# EAGLE design RCM-Comm_v4 (EAGLE 9.2.2)
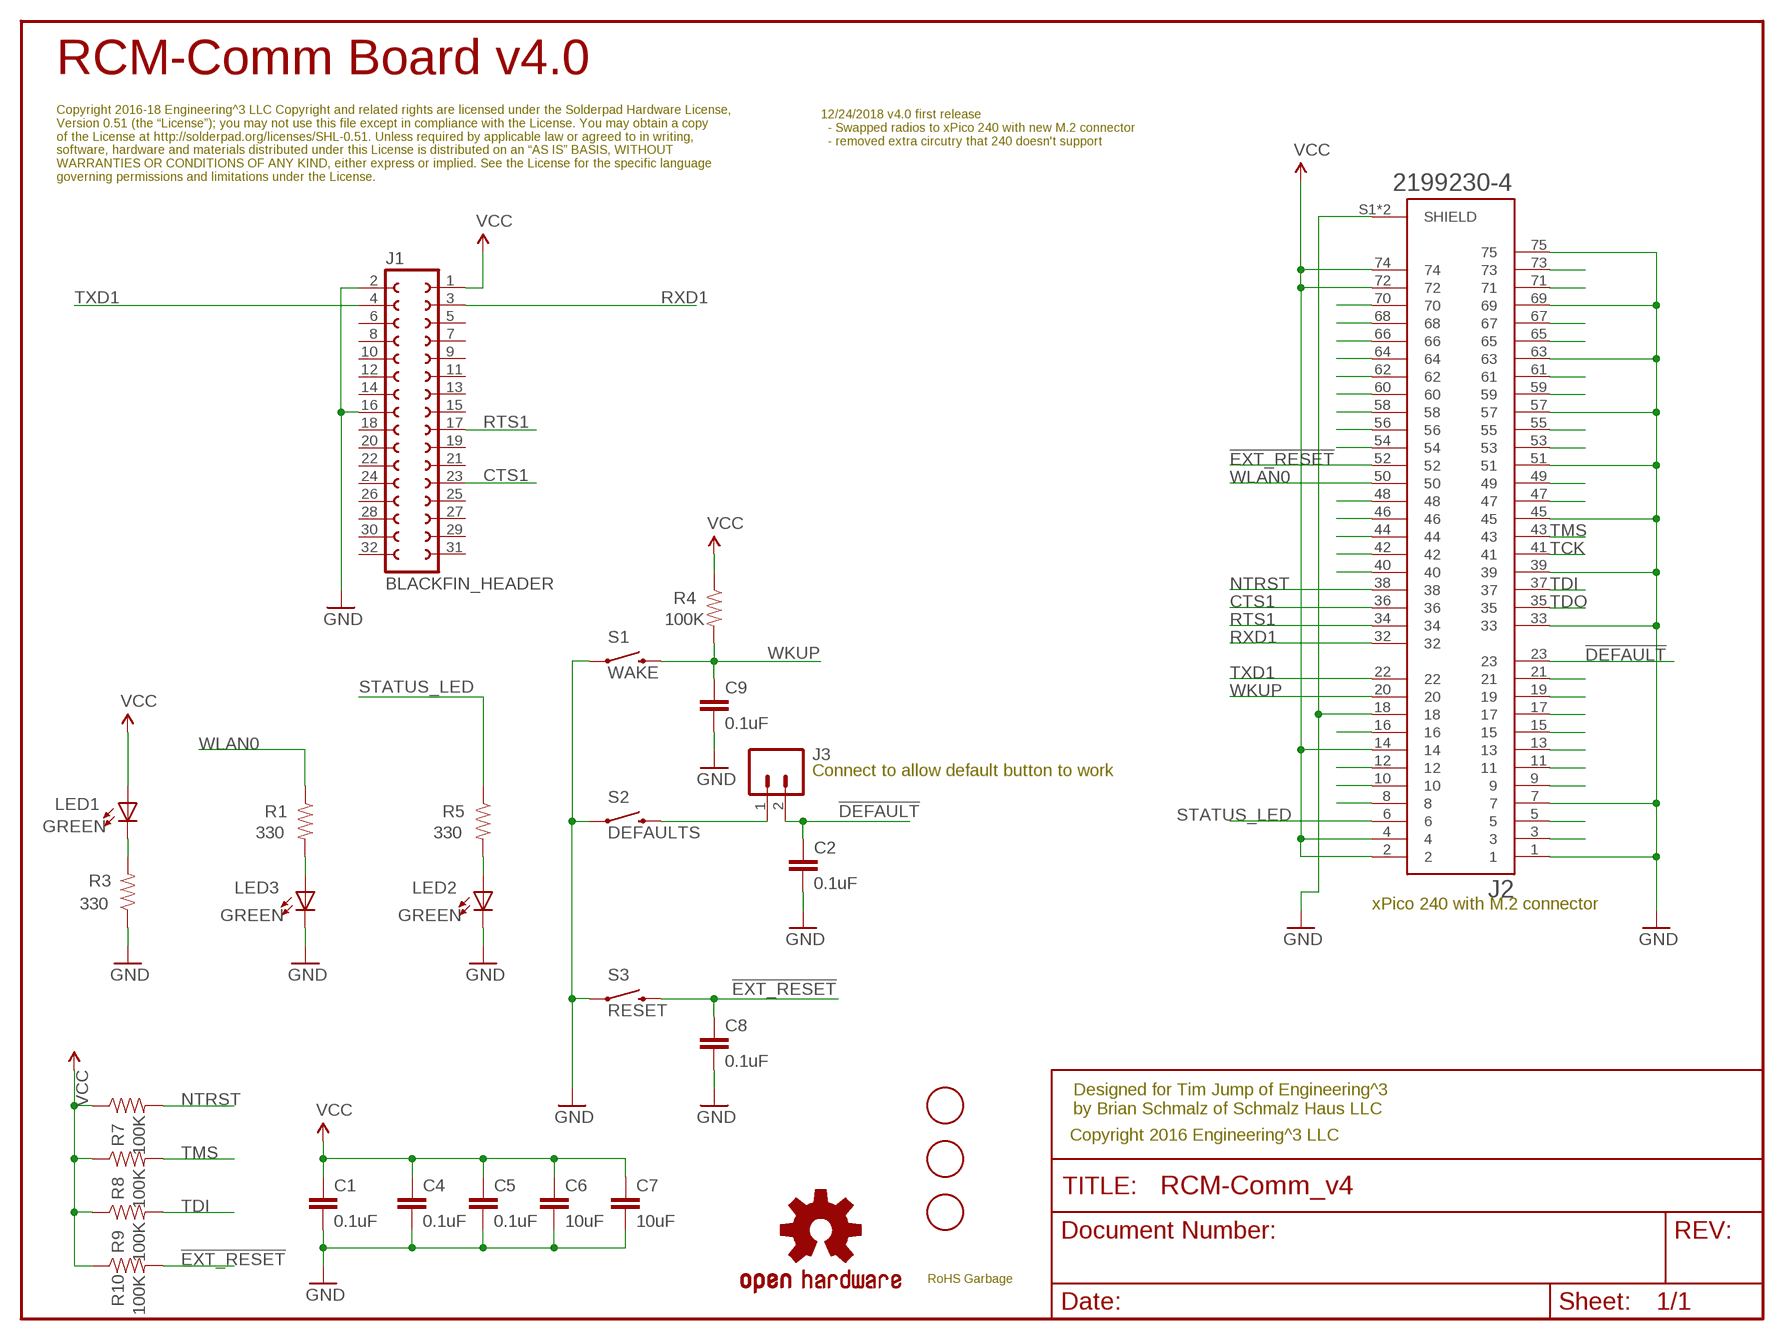
[diagram p0: schematic, sheet 1]

## Parts
C1  0.1uF  0.1UF-25V(+80/-20%)(0603)  [0603-CAP]
C2  0.1uF  0.1UF-25V(+80/-20%)(0603)  [0603-CAP]
C4  0.1uF  0.1UF-25V(+80/-20%)(0603)  [0603-CAP]
C5  0.1uF  0.1UF-25V(+80/-20%)(0603)  [0603-CAP]
C6  10uF  10UF-6.3V-20%(0603)  [0603-CAP]
C7  10uF  10UF-6.3V-20%(0603)  [0603-CAP]
C8  0.1uF  0.1UF-25V(+80/-20%)(0603)  [0603-CAP]
C9  0.1uF  0.1UF-25V(+80/-20%)(0603)  [0603-CAP]
FID1  FIDUCIAL  [FIDUCIAL_1MM]
FID2  FIDUCIAL  [FIDUCIAL_1MM]
FID3  FIDUCIAL  [FIDUCIAL_1MM]
J1  BLACKFIN_HEADER  [2X16]
J2  2199230-4  [TE_2199230-4]
J3  CONN_02  [1X02]
LED1  GREEN  LED0603  [LED-0603]
LED2  GREEN  LED0603  [LED-0603]
LED3  GREEN  LED0603  [LED-0603]
LOGO1  OSHW-LOGOM  [OSHW-LOGO-M]
R1  330  RESISTOR0603-RES  [0603-RES]
R3  330  RESISTOR0603-RES  [0603-RES]
R4  100K  RESISTOR0603-RES  [0603-RES]
R5  330  RESISTOR0603-RES  [0603-RES]
R7  100K  RESISTOR0603-RES  [0603-RES]
R8  100K  RESISTOR0603-RES  [0603-RES]
R9  100K  RESISTOR0603-RES  [0603-RES]
R10  100K  RESISTOR0603-RES  [0603-RES]
S1  WAKE  SWITCH-MOMENTARY-2SMD  [TACTILE-SWITCH-SMD]
S2  DEFAULTS  SWITCH-MOMENTARY-2SMD  [TACTILE-SWITCH-SMD]
S3  RESET  SWITCH-MOMENTARY-2SMD  [TACTILE-SWITCH-SMD]
U$3  ROHS_GARBAGE  [ROHS_GARBAGE_5MM]

## Nets
!DEFAULT!: C2.1 J2.23 J3.2
!EXT_RESET!: C8.1 J2.52 R10.2 S3.3
CTS1: J1.23(GP6) J2.36
GND: C1.2 C2.2 C4.2 C5.2 C6.2 C7.2 C8.2 C9.2 J1.2(GND) J1.16(GND16) J2.1 J2.7 J2.18 J2.33 J2.39 J2.45 J2.51 J2.57 J2.63 J2.69 J2.75 J2.S1(SHIELD) J2.S2(SHIELD) LED2.C LED3.C R3.1 S1.1 S2.1 S3.1
N$1: J3.1 S2.3
N$2: LED3.A R1.2
N$3: LED1.C R3.2
N$6: LED2.A R5.2
N$9: J2.3
N$10: J2.5
N$12: J2.9
N$13: J2.11
N$14: J2.13
N$15: J2.15
N$16: J2.17
N$17: J2.19
N$18: J2.21
N$23: J2.8
N$25: J2.10
N$27: J2.12
N$29: J2.16
N$40: J2.47
N$41: J2.49
N$43: J2.53
N$44: J2.55
N$46: J2.59
N$47: J2.61
N$49: J2.65
N$50: J2.67
N$52: J2.71
N$53: J2.73
N$58: J2.70
N$59: J2.68
N$60: J2.66
N$61: J2.64
N$62: J2.62
N$63: J2.60
N$64: J2.58
N$65: J2.56
N$66: J2.54
N$69: J2.48
N$70: J2.46
N$71: J2.44
N$72: J2.42
N$73: J2.40
NTRST: J2.38 R7.2
RTS1: J1.17(GP0) J2.34
RXD1: J1.3(TX0) J2.32
STATUS_LED: J2.6 R5.1
TCK: J2.41
TDI: J2.37 R9.2
TDO: J2.35
TMS: J2.43 R8.2
TXD1: J1.4(RX0) J2.22
VCC: C1.1 C4.1 C5.1 C6.1 C7.1 J1.1(3.3V) J2.2 J2.4 J2.14 J2.72 J2.74 LED1.A R4.1 R7.1 R8.1 R9.1 R10.1
WKUP: C9.1 J2.20 R4.2 S1.3
WLAN0: J2.50 R1.1
Unconnected: J1.5(TX1) J1.6(RX1) J1.7(TMR2) J1.8(TMR3) J1.9(SPI_MOSI) J1.10(SPI_MISO) J1.11(SPI_SCK) J1.12(SPI_SEL) J1.13(SPI_SEL2) J1.14(SPI_SCL) J1.15(I2C_SDA) J1.18(GP1) J1.19(GP2) J1.20(GP3) J1.21(GP4) J1.22(GP5) J1.24(GP7) J1.25(GP8) J1.26(GP9) J1.27(GPA) J1.28(GPB) J1.29(GPC) J1.30(GPD) J1.31(GPE) J1.32(GPF)

## Notes on the sheet
- RCM-Comm Board v4.0
- 12/24/2018 v4.0 first release
    - Swapped radios to xPico 240 with new M.2 connector
    - removed extra circutry that 240 doesn't support
- Copyright 2016-18 Engineering^3 LLC Copyright and related rights are licensed under the Solderpad Hardware License, 
  Version 0.51 (the “License”); you may not use this file except in compliance with the License. You may obtain a copy 
  of the License at http://solderpad.org/licenses/SHL-0.51. Unless required by applicable law or agreed to in writing, 
  software, hardware and materials distributed under this License is distributed on an “AS IS” BASIS, WITHOUT 
  WARRANTIES OR CONDITIONS OF ANY KIND, either express or implied. See the License for the specific language 
  governing permissions and limitations under the License.
- Connect to allow default button to work
- xPico 240 with M.2 connector
- Designed for Tim Jump of Engineering^3
  by Brian Schmalz of Schmalz Haus LLC
- Copyright 2016 Engineering^3 LLC

## Library data of the parts
C1 C2 C4 C5 C8 C9 = SparkFun-Capacitors:0.1UF-25V(+80/-20%)(0603): CAP-00810 Ceramic Standard decoupling cap; PROD_ID: CAP-00810
C6 C7 = SparkFun-Capacitors:10UF-6.3V-20%(0603): CAP-11015; PROD_ID: CAP-11015
FID1-FID3 = adafruit:FIDUCIAL: For use by pick and place machines to calibrate the vision/machine, 1mm By microbuilder.eu
J1 = Surveyor:BLACKFIN_HEADER
J2 = TE_Conn_M_2_Connector_2199230-4:2199230-4: CONNECTOR, BACKPLANE, HOUSING, RCPT, 67POS, 2ROW; Connector Type: Card Edge; Seri; COMMENT: 2199230-4; DESCRIPTION: Connector, Backplane, Housing, Receptacle, 67 Position, 2row; DIGI-KEY_PART_NUMBER: A115904CT-ND; DIGI-KEY_PURCHASE_URL: https://www.digikey.com/product-detail/en/te-connectivity-amp-connectors/2199230-4/A115904CT-ND/4208916?utm_source=snapeda&utm_medium=aggregator&utm_campaign=symbol; EU_ROHS_COMPLIANCE: Compliant; MF: TE Connectivity; MP: 2199230-4; PACKAGE: None; TE_PURCHASE_URL: https://www.te.com/usa-en/product-2199230-4.html?te_bu=Cor&te_type=disp&te_campaign=seda_glo_cor-seda-global-disp-prtnr-fy19-seda-model-bom-cta_sma-317_1&elqCampaignId=32493
J3 = SparkFun-Connectors:CONN_02: Multi connection point. Often used as Generic Header-pin footprint for 0.1 inch spaced/style header connections On any of the 0.1 inch spaced packages, you can populate with these: Break Away Headers - Straight <https://www.sparkfun.com/products/116> (PRT-00116) Break Away Male Headers - Right Angle <https://www.sparkfun.com/products/553> (PRT-00553) Female Headers <https://www.sparkfun.com/products/115> (PRT-00115) Break Away Headers - Machine Pin <https://www.sparkfun.com/products/117> (PRT-00117) Break Away Female Headers - Swiss Machine Pin <https://www.sparkfun.com/products/743> (PRT-00743) For SCREWTERMINALS and SPRING TERMINALS visit here: Screw Terimnals on SparkFun.com <https://www.sparkfun.com/search/results?term=Screw+Terminals> (5mm/3.5mm/2.54mm spacing) This device is also useful as a general connection point to wire up your design to another part of your project. Our various solder wires solder well into these plated through hole pads. Hook-Up Wire - Assortment (Stranded, 22 AWG) <https://www.sparkfun.com/products/11375> (PRT-11375) Hook-Up Wire - Assortment (Solid Core, 22 AWG) <https://www.sparkfun.com/products/11367> (PRT-11367) View the entire wire category on our website here <https://www.sparkfun.com/categories/141> Special notes: Molex polarized connector foot print use with: PRT-08233 with associated crimp pins and housings. 2.54_SCREWTERM for use with PRT-10571. 3.5mm Screw Terminal footprints for PRT-08084 5mm Screw Terminal footprints for use with PRT-08432
LED1-LED3 = spark_fun:LED: LEDs Standard schematic elements and footprints for 5mm, 3mm, 1206, and 0603 sized LEDs. 5mm - Spark Fun Electronics SKU : COM-00529 (and others)
LOGO1 = SparkFun-Aesthetics:OSHW-LOGO: Open Source Hardware Logo This logo indicates the piece of hardware it is found on incorporates a OSHW license and/or adheres to the definition of open source hardware found here: http://freedomdefined.org/OSHW
R1 R3-R5 R7-R10 = spark_fun:RESISTOR: Resistor Basic schematic elements and footprints for 0603, 1206, and PTH resistors.
S1-S3 = SparkFun-Electromechanical:SWITCH-MOMENTARY-2: Various NO switches- pushbuttons, reed, etc; PROD_ID: SWCH-08247
U$3 = SchmalzHausPublic:ROHS_GARBAGE

## Board
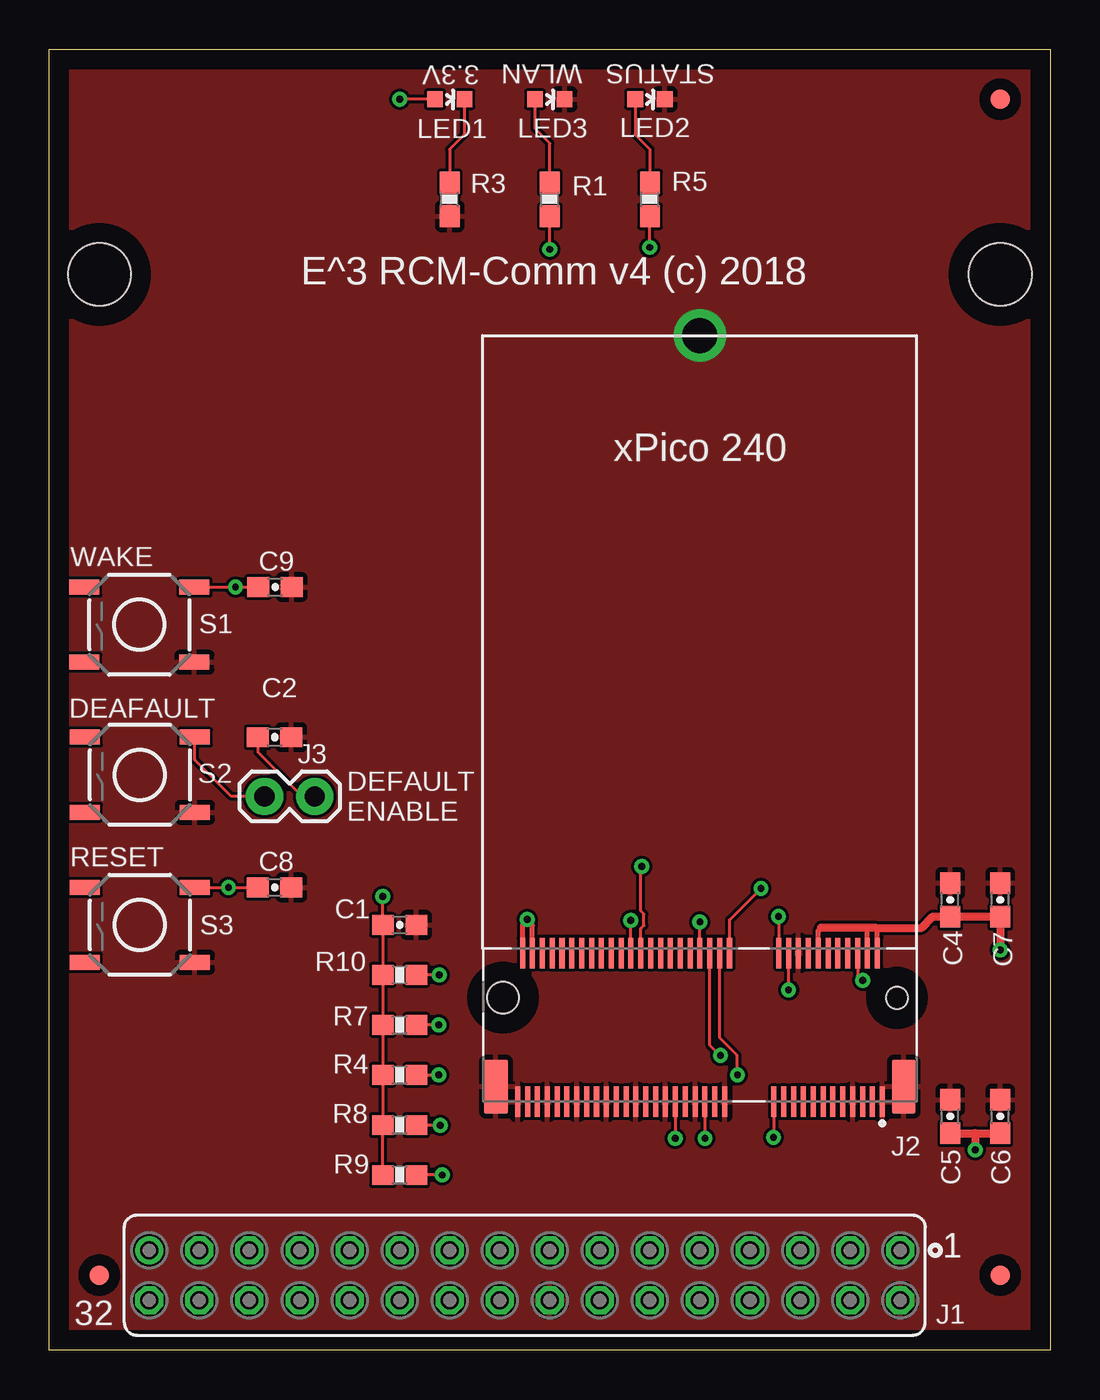
[diagram p1: board, top side]
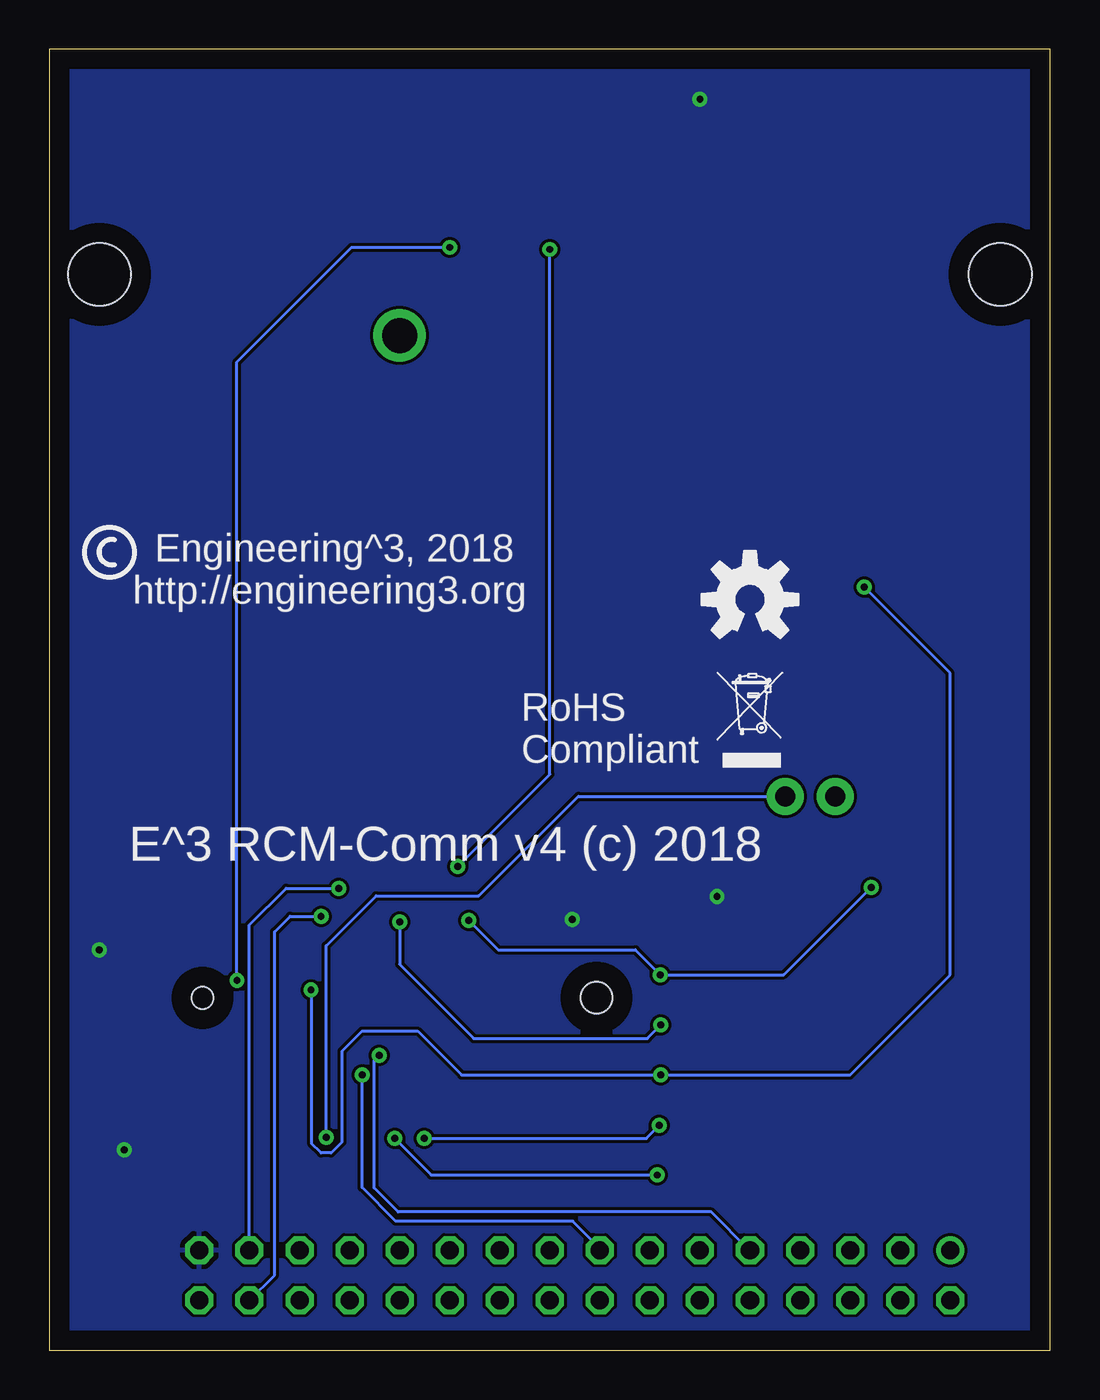
[diagram p2: board, bottom side, seen from below]

Size 50.8 x 66.05 mm. Coordinates in mm from the lower left corner, seen from the top.
Outline: 0,66.05 50.8,66.05 50.8,43.69 50.8,0 0,0.01 0,66.05
Copper layers (1*16): Top 0.035mm / dielectric 1.5mm / Bottom 0.035mm
Design rules "default *": minimum track width 6mil, minimum drill 0.35mm, track to track 6mil, track to pad 6mil, pad to pad 6mil, via to via 6mil, smd to smd 6mil, copper to edge 40mil, drill to drill 6mil, minimum pad ring 10mil, minimum via ring 8mil, stop-mask expansion 4mil, vias tented up to drill 40mil, thermal gap 10mil
Holes 3.17 mm at 2.54,54.62 48.26,54.62

### Footprints (pad centres in the part's own frame; a part is rotated, then mirrored left to right if it is on the bottom)
0603-CAP = smd 1.1 x 1: 1 -0.85,0; 2 0.85,0
FIDUCIAL_1MM = smd 1 x 1: 1 0,0
2X16 = drill 0.914 octagon: 1 20.32,1.27; 2 20.32,-1.27; 3 17.78,1.27; 4 17.78,-1.27; 5 15.24,1.27; 6 15.24,-1.27; 7 12.7,1.27; 8 12.7,-1.27; 9 10.16,1.27; 10 10.16,-1.27; 11 7.62,1.27; 12 7.62,-1.27; 13 5.08,1.27; 14 5.08,-1.27; 15 2.54,1.27; 16 2.54,-1.27; 17 0,1.27; 18 0,-1.27; 19 -2.54,1.27; 20 -2.54,-1.27; 21 -5.08,1.27; 22 -5.08,-1.27; 23 -7.62,1.27; 24 -7.62,-1.27; 25 -10.16,1.27; 26 -10.16,-1.27; 27 -12.7,1.27; 28 -12.7,-1.27; 29 -15.24,1.27; 30 -15.24,-1.27; 32 -17.78,-1.27 | drill 0.914: 31 -17.78,1.27
TE_2199230-4 = smd 0.3 x 1.55: 1 -9.25,3.9; 2 -9,-3.65; 3 -8.75,3.9; 4 -8.5,-3.65; 5 -8.25,3.9; 6 -8,-3.65; 7 -7.75,3.9; 8 -7.5,-3.65; 9 -7.25,3.9; 10 -7,-3.65; 11 -6.75,3.9; 12 -6.5,-3.65; 13 -6.25,3.9; 14 -6,-3.65; 15 -5.75,3.9; 16 -5.5,-3.65; 17 -5.25,3.9; 18 -5,-3.65; 19 -4.75,3.9; 20 -4.5,-3.65; 21 -4.25,3.9; 22 -4,-3.65; 23 -3.75,3.9; 32 -1.5,-3.65; 33 -1.25,3.9; 34 -1,-3.65; 35 -0.75,3.9; 36 -0.5,-3.65; 37 -0.25,3.9; 38 0,-3.65; 39 0.25,3.9; 40 0.5,-3.65; 41 0.75,3.9; 42 1,-3.65; 43 1.25,3.9; 44 1.5,-3.65; 45 1.75,3.9; 46 2,-3.65; 47 2.25,3.9; 48 2.5,-3.65; 49 2.75,3.9; 50 3,-3.65; 51 3.25,3.9; 52 3.5,-3.65; 53 3.75,3.9; 54 4,-3.65; 55 4.25,3.9; 56 4.5,-3.65; 57 4.75,3.9; 58 5,-3.65; 59 5.25,3.9; 60 5.5,-3.65; 61 5.75,3.9; 62 6,-3.65; 63 6.25,3.9; 64 6.5,-3.65; 65 6.75,3.9; 66 7,-3.65; 67 7.25,3.9; 68 7.5,-3.65; 69 7.75,3.9; 70 8,-3.65; 71 8.25,3.9; 72 8.5,-3.65; 73 8.75,3.9; 74 9,-3.65; 75 9.25,3.9 | smd 1.2 x 2.75: S1 -10.35,3.125; S2 10.35,3.125 | hole 1.1: -10,-1.375 | hole 1.6: 10,-1.375
1X02 = drill 1.016 pad 1.88: 1 0,0; 2 2.54,0
LED-0603 = smd 0.8 x 0.8: A 0,-0.75; C 0,0.75
0603-RES = smd 1.1 x 1: 1 -0.85,0; 2 0.85,0
TACTILE-SWITCH-SMD = smd 1.524 x 0.762: 1 -2.794,1.905; 2 2.794,1.905; 3 -2.794,-1.905; 4 2.794,-1.905

### Placement (x,y rotation side)
C1  17.78,21.59 0 top
C2  11.43,31.12 0 top
C4  45.72,22.86 90 top
C5  45.72,11.87 90 top
C6  48.26,11.87 90 top
C7  48.26,22.86 90 top
C8  11.43,23.5 0 top
C9  11.46,38.74 0 top
FID1  2.54,3.81 0 top
FID2  48.26,63.51 0 top
FID3  48.26,3.81 0 top
J1  22.86,3.81 0 top
J2  33.02,16.52 180 top
J3  10.92,28.12 0 top
LED1  20.32,63.51 270 top
LED2  30.48,63.51 270 top
LED3  25.4,63.51 270 top
LOGO1  15.24,38.11 0 bottom
R1  25.4,58.43 90 top
R3  20.32,58.43 90 top
R4  17.78,13.98 0 top
R5  30.48,58.43 90 top
R7  17.78,16.52 0 top
R8  17.78,11.44 0 top
R9  17.78,8.9 0 top
R10  17.78,19.05 0 top
S1  4.57,36.84 180 top
S2  4.6,29.21 180 top
S3  4.6,21.59 180 top
U$3  16.89,29.6 0 bottom

### Tracks (layer width: path | path; a pad name or v marks a point on that pad's centre or on a via)
!DEFAULT!  (via drill 0.35)
  Top 0.152: J2.23 36.77,10.82 v36.75,10.8 | C2.1 10.58,30.37 12.83,28.12 J3.2
  Bottom 0.152: v36.75,10.8 36.75,20.53 34.21,23.07 29.01,23.07 23.95,28.12 J3.2
!EXT_RESET!  (via drill 0.35)
  Top 0.152: J2.52 v29.52,21.82 | v19.79,19.05 R10.2 | S3.3 v9.09,23.5 C8.1
  Bottom 0.152: v29.52,21.82 28.02,20.32 21.06,20.32 v19.79,19.05 13.54,19.05 v9.09,23.5
CTS1  (via drill 0.35)
  Top 0.152: v34.06,14.97 34.04,14.97 33.53,15.47 J2.36
  Bottom 0.152: J1.23 15.27,5.08 17.2,7.01 33.1,7.01 34.31,8.24 34.31,14.71 v34.06,14.97
GND  (via drill 1.78)
  other vias: 33.02,51.52
  pour Top: 0,66.05 50.8,66.05 50.8,0.01 0,0.01
N$1
  Top 0.152: J3.1 9.25,28.12 7.39,29.98 S2.3
N$2
  Top 0.152: R1.2 25.4,61.27 24.65,62.02 LED3.A
N$3
  Top 0.152: LED1.C 21.07,61.72 20.32,60.97 R3.2
N$6
  Top 0.152: LED2.A 29.73,61.72 30.48,60.97 R5.2
NTRST  (via drill 0.35)
  Top 0.152: J2.38 v33.02,21.75 | v19.76,16.52 R7.2
  Bottom 0.152: v33.02,21.75 33.02,19.59 29.26,15.83 20.45,15.83 v19.76,16.52
RTS1  (via drill 0.35)
  Top 0.152: v34.93,13.98 34.9,14 34.9,14.99 34.04,15.86 34.04,20.15 J2.34
  Bottom 0.152: J1.17 22.86,5.19 24.23,6.56 33.22,6.56 34.93,8.26 v34.93,13.98
RXD1  (via drill 0.35)
  Top 0.152: J2.32 34.52,21.85 v36.12,23.45
  Bottom 0.152: J1.3 40.64,21.59 38.79,23.45 v36.12,23.45
STATUS_LED  (via drill 0.35)
  Top 0.152: J2.6 41.02,19.03 v41.27,18.78 | v30.48,55.99 R5.1
  Bottom 0.152: v41.27,18.78 41.27,50.17 35.46,55.99 v30.48,55.99
TDI  (via drill 0.35)
  Top 0.152: J2.37 v33.27,10.75 | v19.94,8.9 R9.2
  Bottom 0.152: v33.27,10.75 31.42,8.9 v19.94,8.9
TMS  (via drill 0.35)
  Top 0.152: J2.43 v31.77,10.76 v31.77,10.75 | v19.84,11.41 18.66,11.41 R8.2
  Bottom 0.152: v31.77,10.75 20.5,10.75 v19.84,11.41
TXD1  (via drill 0.35)
  Top 0.152: v37.01,22.03 37.01,20.18 J2.22
  Bottom 0.152: J1.4 39.37,3.81 39.37,21.24 38.58,22.03 v37.01,22.03
VCC  (via drill 0.35)
  Top 0.152: 42.02,21.36 41.94,21.44 41.91,21.44 | 41.52,21.43 41.5,21.44 | R9.1 R8.1 R4.1 R7.1 R10.1 C1.1 16.93,23.03 v16.92,23.04 | 24.26,21.82 v24.26,21.87 | LED1.A v17.78,63.51
  Top 0.254: J2.2 42.02,21.36 | 39.17,21.44 39.02,21.3 J2.14 | J2.4 41.52,21.43 | J2.74 24.02,21.59 24.26,21.82 24.52,21.56 J2.72
  Top 0.406: C5.1 46.99,11.02 | 46.99,11.02 C6.1 | 46.99,11.02 v46.99,10.17 | v48.26,20.32 C7.1 C4.1 44.84,22.02 44.27,21.44 41.91,21.44 41.5,21.44 39.17,21.44
  pour Bottom: 0,66.05 50.8,66.05 50.8,0.01 0,0.01
WKUP  (via drill 0.35)
  Top 0.152: R4.2 v19.76,13.98 | v37.52,18.29 J2.20 | S1.3 v9.45,38.74 C9.1
  Bottom 0.152: v37.52,18.29 37.5,18.28 37.5,10.51 37.01,10.01 36.5,10.01 35.94,10.57 35.94,15.19 34.93,16.21 32.11,16.21 29.87,13.98 v19.76,13.98 10.16,13.98 5.08,19.05 5.08,34.37 v9.45,38.74
WLAN0  (via drill 0.35)
  Top 0.152: v30.07,24.57 30.02,24.51 30.02,22.29 30.17,22.14 30.17,21.56 30.02,21.4 J2.50 | v25.4,55.89 R1.1
  Bottom 0.152: v30.07,24.57 25.4,29.24 v25.4,55.89

### Text on the board
tPlace: 3.3V | WLAN | STATUS | E^3 RCM-Comm v4 (c) 2018 | xPico 240 | WAKE | DEAFAULT | DEFAULT / ENABLE | RESET
bPlace: Engineering^3, 2018 / http://engineering3.org | RoHS / Compliant | E^3 RCM-Comm v4 (c) 2018